# EAGLE design inverter logic (EAGLE 7.6.0)
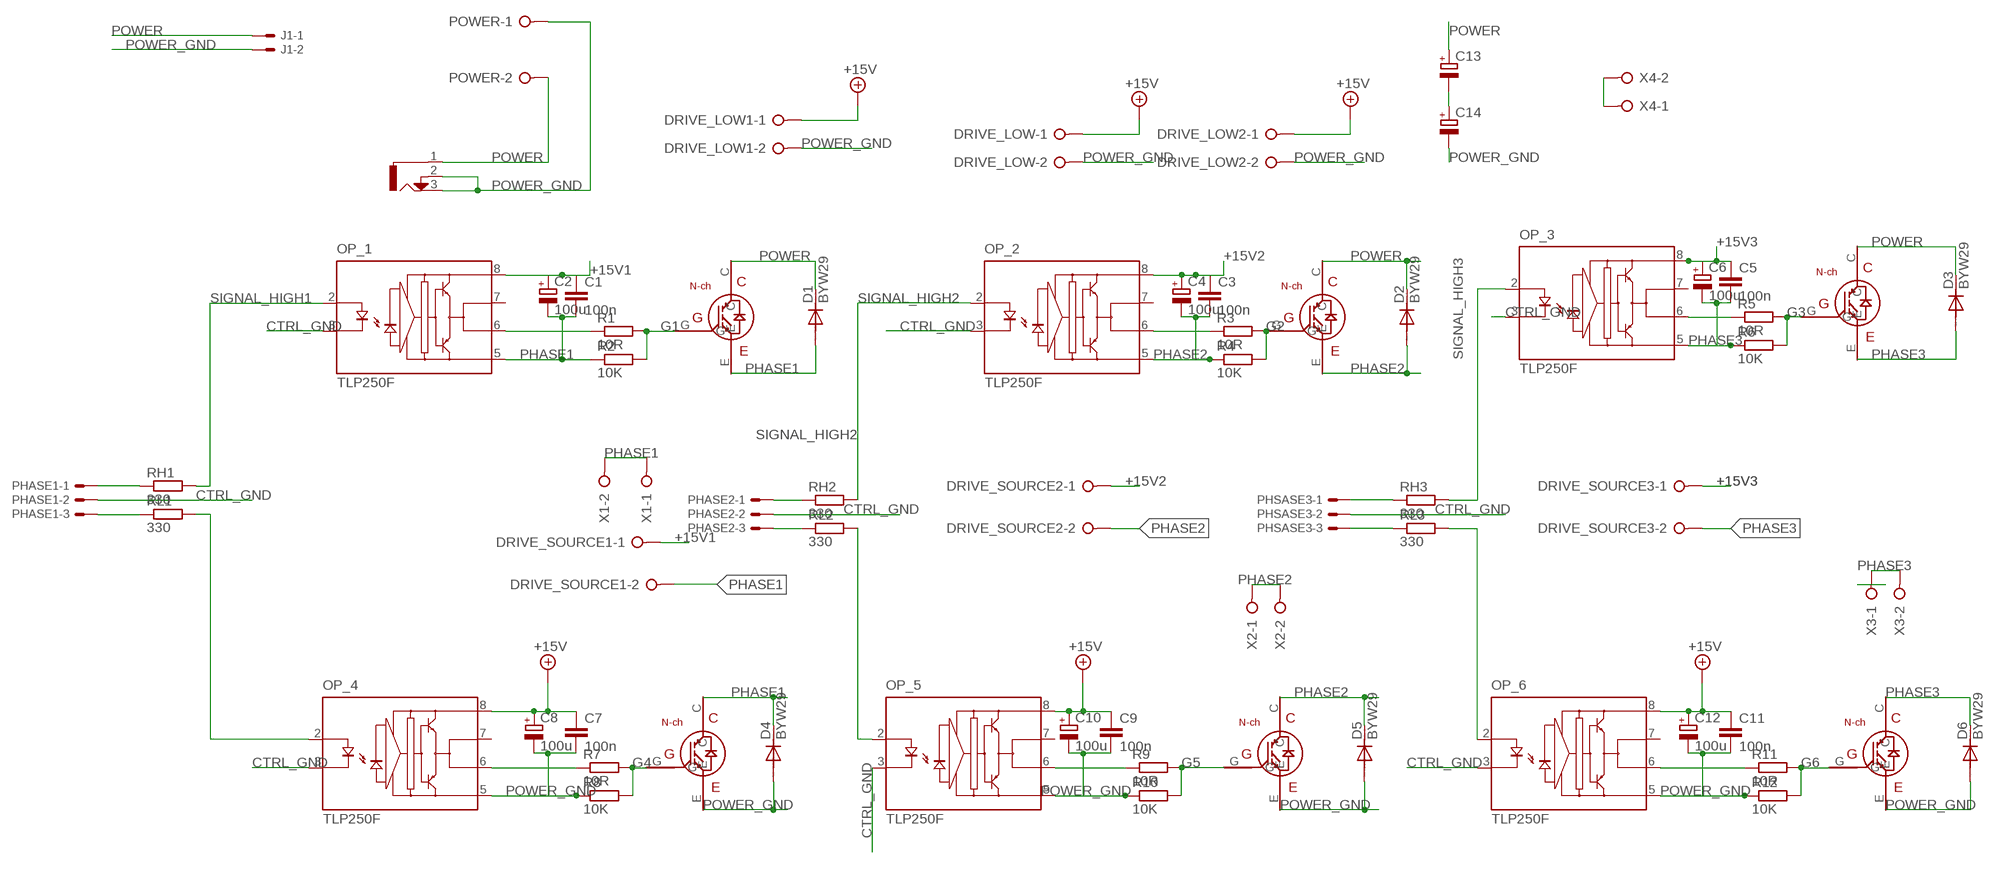
[diagram p0: schematic, sheet 1]

## Parts
C1  100n  C-EU025-025X050  [C025-025X050]
C2  100u  CPOL-EUE2.5-6  [E2,5-6]
C3  100n  C-EU025-025X050  [C025-025X050]
C4  100u  CPOL-EUE2.5-6  [E2,5-6]
C5  100n  C-EU025-025X050  [C025-025X050]
C6  100u  CPOL-EUE2.5-6  [E2,5-6]
C7  100n  C-EU025-025X050  [C025-025X050]
C8  100u  CPOL-EUE2.5-6  [E2,5-6]
C9  100n  C-EU025-025X050  [C025-025X050]
C10  100u  CPOL-EUE2.5-6  [E2,5-6]
C11  100n  C-EU025-025X050  [C025-025X050]
C12  100u  CPOL-EUE2.5-6  [E2,5-6]
C13  CPOL-EUE2.5-6  [E2,5-6]
C14  CPOL-EUE2.5-6  [E2,5-6]
D1  BYW29  [DO220S]
D2  BYW29  [DO220S]
D3  BYW29  [DO220S]
D4  BYW29  [DO220S]
D5  BYW29  [DO220S]
D6  BYW29  [DO220S]
DRIVE_LOW  W237-02P  [W237-132]
DRIVE_LOW1  W237-02P  [W237-132]
DRIVE_LOW2  W237-02P  [W237-132]
DRIVE_SOURCE1  W237-02P  [W237-132]
DRIVE_SOURCE2  W237-02P  [W237-132]
DRIVE_SOURCE3  W237-02P  [W237-132]
J1  22-27-2021-02  [6410-02]
OP_1  TLP250F  [DIL08]
OP_2  TLP250F  [DIL08]
OP_3  TLP250F  [DIL08]
OP_4  TLP250F  [DIL08]
OP_5  TLP250F  [DIL08]
OP_6  TLP250F  [DIL08]
PHASE1  22-27-2031-03  [6410-03]
PHASE2  22-27-2031-03  [6410-03]
PHSASE3  22-27-2031-03  [6410-03]
POWER  W237-02P  [W237-132]
R1  10R  R-EU_0207/10  [0207/10]
R2  10K  R-EU_0207/10  [0207/10]
R3  10R  R-EU_0207/10  [0207/10]
R4  10K  R-EU_0207/10  [0207/10]
R5  10R  R-EU_0207/10  [0207/10]
R6  10K  R-EU_0207/10  [0207/10]
R7  10R  R-EU_0207/10  [0207/10]
R8  10K  R-EU_0207/10  [0207/10]
R9  10R  R-EU_0207/10  [0207/10]
R10  10K  R-EU_0207/10  [0207/10]
R11  10R  R-EU_0207/10  [0207/10]
R12  10K  R-EU_0207/10  [0207/10]
RH1  330  R-EU_0207/10  [0207/10]
RH2  330  R-EU_0207/10  [0207/10]
RH3  330  R-EU_0207/10  [0207/10]
RL1  330  R-EU_0207/10  [0207/10]
RL2  330  R-EU_0207/10  [0207/10]
RL3  330  R-EU_0207/10  [0207/10]
T1  TO-247A  [TO-247]
T2  TO-247A  [TO-247]
T3  TO-247A  [TO-247]
T4  TO-247A  [TO-247]
T5  TO-247A  [TO-247]
T6  TO-247A  [TO-247]
U$1  DC-21MM  [DC-21MM]
X1  W237-02P  [W237-132]
X2  W237-02P  [W237-132]
X3  W237-02P  [W237-132]
X4  W237-02P  [W237-132]

## Nets
+15V: C7.1 C8.+ C9.1 C10.+ C11.1 C12.+ DRIVE_LOW1.1 DRIVE_LOW2.1 DRIVE_LOW.1 OP_4.8(VCC) OP_5.8(VCC) OP_6.8(VCC)
+15V1: C1.1 C2.+ DRIVE_SOURCE1.1 OP_1.8(VCC)
+15V2: C3.1 C4.+ DRIVE_SOURCE2.1 OP_2.8(VCC)
+15V3: C5.1 C6.+ DRIVE_SOURCE3.1 OP_3.8(VCC)
CTRL_GND: OP_1.3(K) OP_2.3(K) OP_3.3(K) OP_4.3(K) OP_5.3(K) OP_6.3(K) PHASE1.2 PHASE2.2 PHSASE3.2
G1: R1.2 R2.2 T1.G
G2: R3.2 R4.2 T2.G
G3: R5.2 R6.2 T3.G
G4: R7.2 R8.2 T4.G
G5: R9.2 R10.2 T5.G
G6: R11.2 R12.2 T6.G
N: C13.- C14.+ X4.1 X4.2
N$1: PHASE1.3 RL1.1
N$2: PHASE2.3 RL2.1
N$3: PHSASE3.3 RL3.1
N$5: PHASE2.1 RH2.1
N$7: PHSASE3.1 RH3.1
N$8: OP_3.6(VO) R5.1
N$9: PHASE1.1 RH1.1
N$13: OP_1.6(VO) R1.1
N$15: OP_2.6(VO) R3.1
N$19: OP_4.6(VO) R7.1
N$21: OP_5.6(VO) R9.1
N$24: OP_6.6(VO) R11.1
PHASE1: C1.2 C2.- D1.A D4.C DRIVE_SOURCE1.2 OP_1.5(GND) R2.1 T1.E T4.C X1.1 X1.2
PHASE2: C3.2 C4.- D2.A D5.C DRIVE_SOURCE2.2 OP_2.5(GND) R4.1 T2.E T5.C X2.1 X2.2
PHASE3: C5.2 C6.- D3.A D6.C DRIVE_SOURCE3.2 OP_3.5(GND) R6.1 T3.E T6.C X3.1 X3.2
POWER: C13.+ D1.C D2.C D3.C J1.1 POWER.2 T1.C T2.C T3.C U$1.1
POWER_GND: C7.2 C8.- C9.2 C10.- C11.2 C12.- C14.- D4.A D5.A D6.A DRIVE_LOW1.2 DRIVE_LOW2.2 DRIVE_LOW.2 J1.2 OP_4.5(GND) OP_5.5(GND) OP_6.5(GND) POWER.1 R8.1 R10.1 R12.1 T4.E T5.E T6.E U$1.2 U$1.3
SIGNAL_HIGH1: OP_1.2(A) RH1.2
SIGNAL_HIGH2: OP_2.2(A) RH2.2
SIGNAL_HIGH3: OP_3.2(A) RH3.2
SIGNAL_LOW1: OP_4.2(A) RL1.2
SIGNAL_LOW2: OP_5.2(A) RL2.2
SIGNAL_LOW3: OP_6.2(A) RL3.2
Unconnected: OP_1.7(VO') OP_2.7(VO') OP_3.7(VO') OP_4.7(VO') OP_5.7(VO') OP_6.7(VO')

## Library data of the parts
C1 C3 C5 C7 C9 C11 = rcl:C-EU: CAPACITOR, European symbol
C2 C4 C6 C8 C10 C12-C14 = rcl:CPOL-EU: POLARIZED CAPACITOR, European symbol
D1-D6 = diode:BYW29: DIODE ultra fast rectifier, 200 V, 8 A
DRIVE_LOW DRIVE_LOW1 DRIVE_LOW2 DRIVE_SOURCE1-DRIVE_SOURCE3 POWER X1-X4 = con-wago-508:W237-02P: WAGO SREW CLAMP; OC_FARNELL: unknown; OC_NEWARK: unknown
J1 = con-molex:22-?-02: CONNECTOR wire to board 2.54 mm (.1 inch) pitch header; OC_FARNELL: unknown; OC_NEWARK: unknown
OP_1-OP_6 = optocoupler-3-jcn:TLP250F: Toshiba Transistor Inverter Inverter For Air Conditionor IGBT Gate Drive Power MOS FET Gate Drive
PHASE1 PHASE2 PHSASE3 = con-molex:22-?-03: CONNECTOR wire to board 2.54 mm (.1 inch) pitch header; OC_FARNELL: unknown; OC_NEWARK: unknown
R1-R12 RH1-RH3 RL1-RL3 = rcl:R-EU_: RESISTOR, European symbol
T1-T6 = to-247_n-channel_igbt:TO-247
U$1 = arduino_Uno_Rev3-02-TH:DC-21MM

## Net classes
0 default: width 1.524 mm, drill 0.254 mm, clearance 0.508 mm

## Board
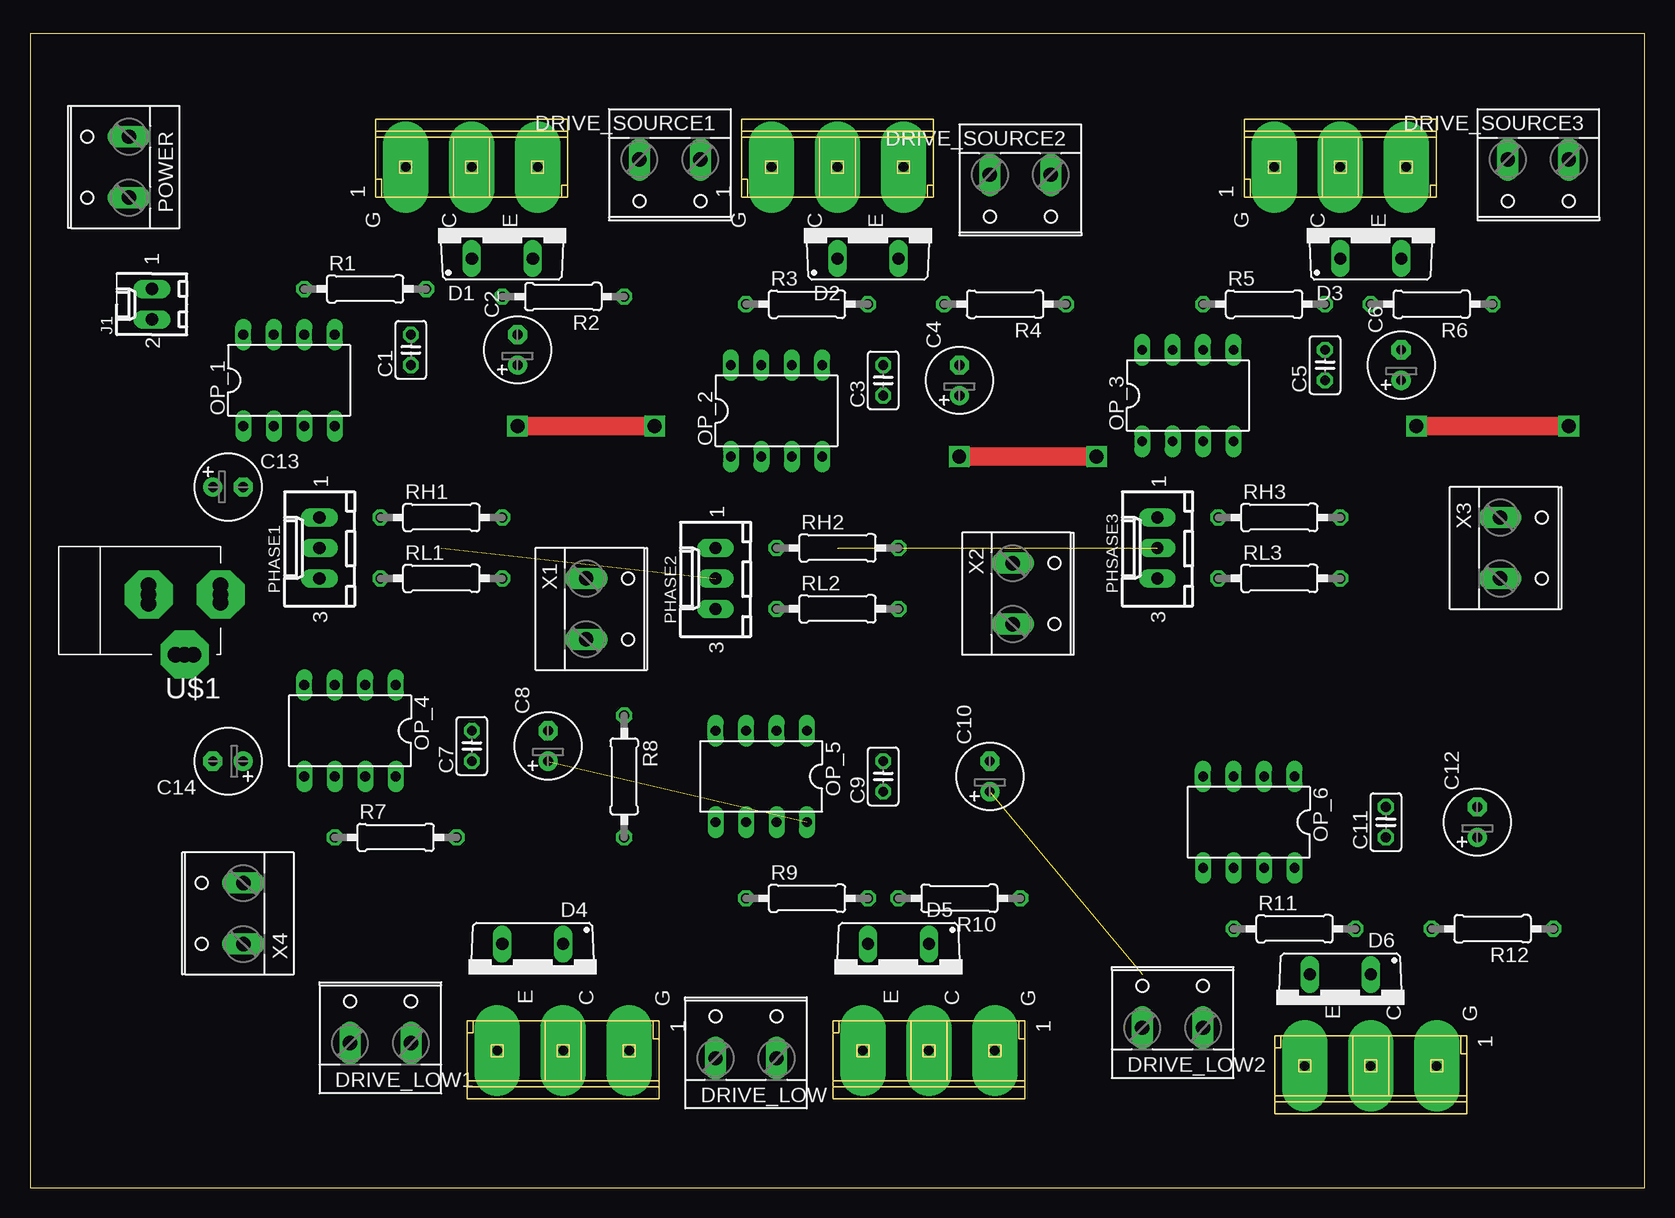
[diagram p1: board, top side]
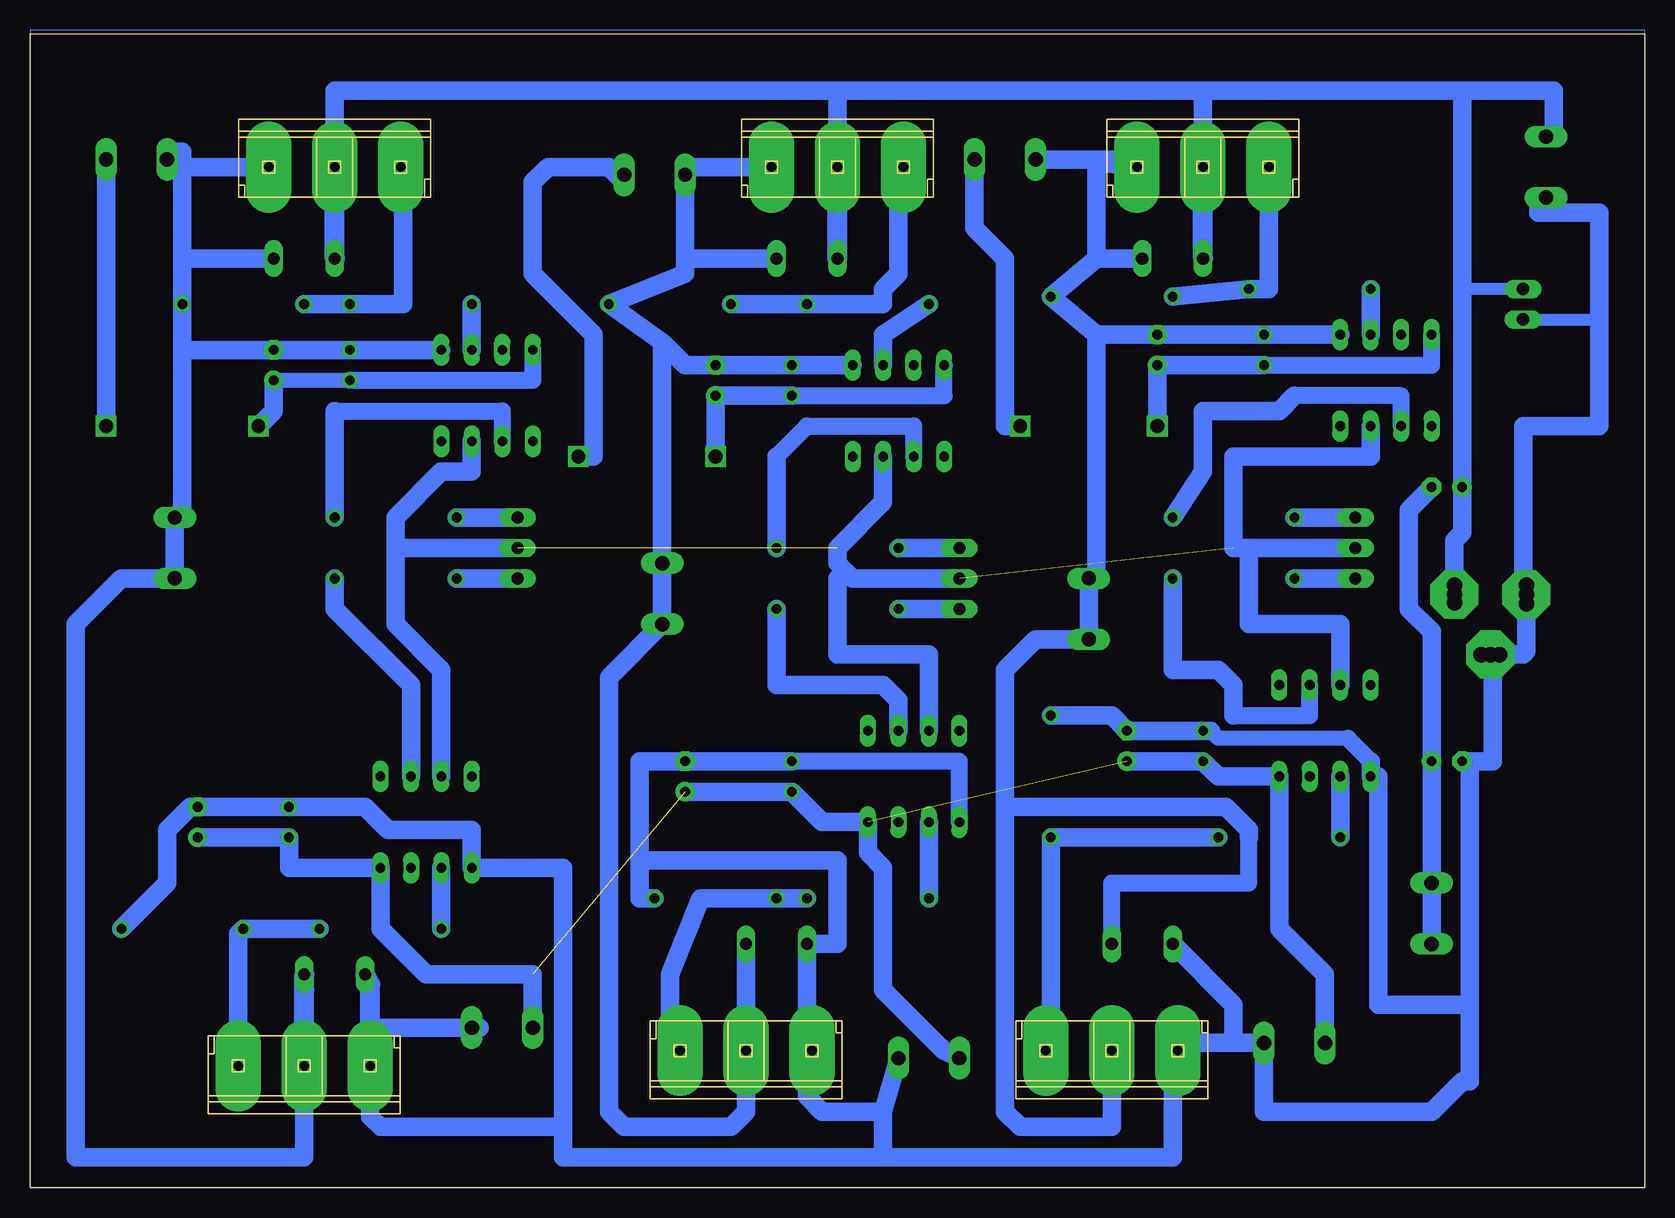
[diagram p2: board, bottom side, seen from below]

Size 134.6 x 96.19 mm. Coordinates in mm from the lower left corner, seen from the top.
Outline: 0,0 134.6,0 134.6,96.19 0,96.19 0,0
Copper layers (1*16): Top 0.035mm / dielectric 1.5mm / Bottom 0.035mm
Design rules "default": minimum track width 10mil, minimum drill 24mil, track to track 8mil, track to pad 8mil, pad to pad 8mil, via to via 8mil, smd to smd 8mil, copper to edge 40mil, drill to drill 8mil, minimum pad ring 10mil, minimum via ring 8mil, stop-mask expansion 4mil, vias tented up to drill 0mil, thermal gap 10mil

### Footprints (pad centres in the part's own frame; a part is rotated, then mirrored left to right if it is on the bottom)
C025-025X050 = drill 0.813 octagon: 1 -1.27,0; 2 1.27,0
E2,5-6 = drill 0.813 pad 1.6: + -1.27,0 | drill 0.813 pad 1.6 octagon: - 1.27,0
DO220S = drill 1.016 long: A 2.54,-2.54; C -2.54,-2.54
W237-132 = drill 1.194 long: 1 -2.54,-0.635; 2 2.54,-0.635
6410-02 = drill 1.016 long: 1 1.27,0; 2 -1.27,0
DIL08 = drill 0.813 long: 1 -3.81,-3.81; 2 -1.27,-3.81; 3 1.27,-3.81; 4 3.81,-3.81; 5 3.81,3.81; 6 1.27,3.81; 7 -1.27,3.81; 8 -3.81,3.81
6410-03 = drill 1.016 long: 1 2.54,0; 2 0,0; 3 -2.54,0
0207/10 = drill 0.813 octagon: 1 -5.08,0; 2 5.08,0
TO-247 = drill 0.8 pad 3.81 long: C 0,0; E 0,-5.5; G 0,5.5
DC-21MM = drill 1.3 pad 4 octagon: 1 -0.076,-3.175; 2 -5.08,-0.178; 3 -0.076,2.819 | drill 1.3: P$1 -0.838,2.819; P$2 -0.762,-3.175; P$3 0.686,2.819; P$4 0.686,-3.175; P$5 -5.08,-0.94; P$6 -5.08,0.584

### Placement (x,y rotation side)
C1  31.75,69.85 90 top
C2  40.64,69.85 90 top
C3  71.12,67.31 90 top
C4  77.47,67.31 90 top
C5  107.95,68.58 90 top
C6  114.3,68.58 90 top
C7  36.83,36.83 90 top
C8  43.18,36.83 90 top
C9  71.12,34.29 90 top
C10  80.01,34.29 90 top
C11  113.03,30.48 90 top
C12  120.65,30.48 90 top
C13  16.51,58.42 0 top
C14  16.51,35.56 180 top
D1  39.37,80.01 0 top
D2  69.85,80.01 0 top
D3  111.76,80.01 0 top
D4  41.91,17.78 180 top
D5  72.39,17.78 180 top
D6  109.22,15.24 180 top
DRIVE_LOW  59.69,11.43 0 top
DRIVE_LOW1  29.21,12.7 0 top
DRIVE_LOW2  95.25,13.97 0 top
DRIVE_SOURCE1  53.34,85.09 180 top
DRIVE_SOURCE2  82.55,83.82 180 top
DRIVE_SOURCE3  125.73,85.09 180 top
J1  10.16,73.66 90 top
OP_1  21.59,67.31 0 top
OP_2  62.23,64.77 0 top
OP_3  96.52,66.04 0 top
OP_4  26.67,38.1 180 top
OP_5  60.96,34.29 180 top
OP_6  101.6,30.48 180 top
PHASE1  24.13,53.34 90 top
PHASE2  57.15,50.8 90 top
PHSASE3  93.98,53.34 90 top
POWER  7.62,85.09 90 top
R1  27.94,74.93 0 top
R2  44.45,74.29 180 top
R3  64.77,73.66 0 top
R4  81.28,73.66 180 top
R5  102.87,73.66 0 top
R6  116.84,73.66 180 top
R7  30.48,29.21 0 top
R8  49.53,34.29 270 top
R9  64.77,24.13 0 top
R10  77.47,24.13 180 top
R11  105.41,21.59 0 top
R12  121.92,21.59 180 top
RH1  34.29,55.88 0 top
RH2  67.31,53.34 0 top
RH3  104.14,55.88 0 top
RL1  34.29,50.8 0 top
RL2  67.31,48.26 0 top
RL3  104.14,50.8 0 top
T1  36.83,85.09 90 top
T2  67.31,85.09 90 top
T3  109.22,85.09 90 top
T4  44.45,11.43 270 top
T5  74.93,11.43 270 top
T6  111.76,10.16 270 top
U$1  12.7,49.53 90 top
X1  46.99,48.26 270 top
X2  82.55,49.53 270 top
X3  123.19,53.34 270 top
X4  17.15,22.86 90 top

### Tracks (layer width: path | path; a pad name or v marks a point on that pad's centre or on a via)
+15V  (2 unrouted)
  Bottom 1.524: C8.+ C7.1 35.56,34.29 OP_4.8 30.48,21.59 26.67,17.78 DRIVE_LOW1.1 | DRIVE_LOW.1 58.42,11.43 63.5,16.51 63.5,26.67 64.77,27.94 OP_5.8 68.58,30.48 C9.1 C10.+ | C12.+ C11.1 113.03,26.67 OP_6.8 105.41,21.59 101.6,17.78 92.71,17.78 DRIVE_LOW2.1 92.71,12.7
+15V1  (via drill 1.14)
  Top 1.524: v40.64,63.5 v52.07,63.5
  Bottom 1.422: C1.1 17.78,68.58 OP_1.8
  Bottom 1.524: C1.1 C2.+ v40.64,63.5 | v52.07,63.5 53.34,63.5 53.34,77.47 55.88,80.01 DRIVE_SOURCE1.1
+15V2  (via drill 1.14)
  Top 1.524: v77.47,60.96 v88.9,60.96
  Bottom 1.422: C3.1 58.42,66.04 OP_2.8
  Bottom 1.524: C3.1 C4.+ v77.47,60.96 | v88.9,60.96 87.63,60.96 87.63,71.12 92.71,76.2 92.71,83.82 91.44,85.09 86.36,85.09 85.41,84.14 | 85.41,84.14 85.09,83.82 | DRIVE_SOURCE2.1 85.41,84.14
+15V3  (via drill 1.14)
  Top 1.524: v115.57,63.5 v128.27,63.5
  Bottom 1.27: C5.1 C6.+
  Bottom 1.422: OP_3.8 92.71,67.31 C5.1
  Bottom 1.524: C6.+ 114.3,64.77 v115.57,63.5 | v128.27,63.5 DRIVE_SOURCE3.1
CTRL_GND  (2 unrouted)
  Bottom 1.524: 66.67,51.44 66.04,50.8 PHASE2.2 | 66.67,51.44 67.31,52.07 67.31,53.34 63.5,57.15 OP_2.3 | OP_5.3 59.69,44.45 67.31,44.45 67.31,50.8 66.67,51.44 | OP_3.3 97.79,59.69 100.33,59.69 104.14,55.88 104.14,53.34 | 104.14,53.34 104.14,46.99 100.33,43.18 OP_6.3 | 22.86,62.23 OP_1.3 22.86,60.96 34.29,60.96 34.29,53.34 33.02,53.34 | PHASE1.2 33.02,53.34 | 33.02,53.34 33.02,46.99 25.4,46.99 OP_4.3 | PHSASE3.2 104.14,53.34
G1
  Bottom 1.524: R2.2 R1.2 31.33,74.93 T1.G
G2
  Bottom 1.524: R4.2 R3.2 63.5,73.66 63.5,74.93 62.23,76.2 62.23,84.67 T2.G
G3
  Bottom 1.524: R6.2 R5.2 103.5,73.66 103.5,84.88 T3.G
G4
  Bottom 1.524: R7.2 R8.2 49.53,11.85 T4.G
G5
  Bottom 1.524: R9.2 R10.2 78.74,24.13 81.28,17.78 81.28,11.43 80.01,10.16 80.01,11.01 T5.G
G6
  Bottom 1.524: R11.2 R12.2 117.26,21.17 T6.G
N
  Bottom 1.524: C13.- 19.69,56.52 19.69,48.26 17.78,46.36 C14.+ X4.2 X4.1
N$1
  Bottom 1.524: PHASE1.3 RL1.1
N$2
  Bottom 1.524: PHASE2.3 RL2.1
N$3
  Bottom 1.524: PHSASE3.3 RL3.1
N$4
  Bottom 0: 1.27,96.52 134.62,96.52 134.62,0 0,0 0,96.52 2.54,96.52
N$5
  Bottom 1.524: PHASE2.1 RH2.1
N$7
  Bottom 1.524: PHSASE3.1 RH3.1
N$8
  Bottom 1.524: R5.1 OP_3.6
N$9
  Bottom 1.524: PHASE1.1 RH1.1
N$13
  Bottom 1.524: OP_1.6 R1.1
N$15
  Bottom 1.524: OP_2.6 63.5,71.12 R3.1
N$19
  Bottom 1.524: OP_4.6 R7.1
N$21
  Bottom 1.524: R9.1 OP_5.6
N$24
  Bottom 1.524: OP_6.6 R11.1
PHASE1
  Bottom 1.422: D4.C 44.45,25.4 33.02,25.4 33.02,29.21
  Bottom 1.524: 45.72,71.12 45.72,50.8 X1.1 X1.2 50.8,45.72 53.34,43.18 53.34,31.75 | 45.72,71.12 C2.- C1.2 OP_1.5 | DRIVE_SOURCE1.2 41.7,85.72 T1.E 45.72,85.51 45.72,77.47 | 53.34,31.75 53.34,6.35 52.07,5.08 44.45,5.08 T4.C | 45.72,77.47 R2.1 45.72,71.12 | 45.72,77.47 D1.A | 53.34,31.75 34.93,31.75 33.02,29.84 33.02,29.21
PHASE2
  Bottom 1.524: OP_2.5 C3.2 C4.- 80.01,68.58 81.92,70.48 | 81.92,70.48 R4.1 80.01,76.2 80.01,77.47 | 80.01,77.47 DRIVE_SOURCE2.2 79.38,85.09 T2.E | 81.92,70.48 X2.1 X2.2 86.36,42.55 86.36,6.35 85.09,5.08 76.2,5.08 74.93,6.35 T5.C D5.C | 80.01,77.47 D2.A
PHASE3
  Bottom 1.524: T3.E 121.92,85.09 | DRIVE_SOURCE3.2 122.55,86.36 121.92,86.36 121.92,85.09 | 121.92,69.85 C6.- C5.2 OP_3.5 | 121.92,69.85 121.92,56.52 X3.1 122.55,51.44 123.19,50.8 | 123.19,50.8 127,50.8 130.81,46.99 130.81,2.54 111.76,2.54 111.76,16.51 | X3.2 123.19,50.8 | 121.92,69.85 R6.1 121.92,77.47 | 121.92,85.09 121.92,77.47 | D3.A 121.92,77.47
  Bottom 1.676: T6.C 111.76,16.51 D6.C
POWER
  Bottom 1.016: J1.1 15.24,74.93
  Bottom 1.524: 15.24,91.44 15.24,74.93 C13.+ 15.24,54.61 15.88,53.98 U$1.1 | 67.31,91.44 109.22,91.44 T3.C | 67.31,91.44 36.83,91.44 | 36.83,91.44 15.24,91.44 | T1.C 36.83,91.44 | T2.C 67.31,91.44 | 15.24,91.44 7.62,91.44 7.62,87.63 POWER.2
  Bottom 1.676: D1.C T1.C | D2.C T2.C | D3.C T3.C
POWER_GND
  Bottom 1.016: J1.2 3.81,72.39
  Bottom 1.27: 36.2,38.1 35.56,37.47 24.77,37.47
  Bottom 1.422: OP_5.5 57.15,35.56 C9.2 | 22.86,35.56 24.77,37.47
  Bottom 1.524: 34.29,12.07 DRIVE_LOW1.2 31.75,6.35 17.78,6.35 15.24,8.89 14.61,8.89 14.61,15.24 | 34.29,12.07 38.31,12.07 T4.E 39.37,11.01 39.37,2.54 63.5,2.54 | R8.1 44.45,39.37 C8.- C7.2 36.2,38.1 | 63.5,6.35 68.58,6.35 69.85,7.62 69.85,11.43 | 69.85,11.43 T5.E | C9.2 C10.- 83.82,35.56 83.82,27.3 | 83.82,27.3 83.82,24.13 R10.1 | DRIVE_LOW.2 63.5,6.35 | 63.5,2.54 90.17,2.54 90.17,5.08 | 14.61,35.56 12.7,35.56 12.7,44.45 | 14.61,35.56 C14.- | 22.86,35.56 OP_4.5 22.23,34.29 22.23,15.24 14.61,15.24 | 12.7,44.45 10.16,44.45 9.88,44.73 U$1.3 10.16,49.45 10.16,63.5 3.81,63.5 3.81,72.39 3.81,81.28 8.89,81.28 8.89,82.55 POWER.1 | 14.61,15.24 14.61,35.56 | D4.A 34.29,15.24 34.29,12.07 | 63.5,2.54 63.5,6.35 | R12.1 123.19,25.4 123.19,29.84 121.28,31.75 C12.- C11.2 106.68,31.75 104.77,29.84 97.79,29.84 OP_6.5 90.17,26.67 90.17,5.08 | 97.16,13.34 DRIVE_LOW2.2 105.62,13.34 T6.E 106.26,5.93 105.41,5.08 90.17,5.08 | 69.85,11.43 D5.A 67.31,20.32 67.31,27.3 83.82,27.3 | 12.7,44.45 U$1.2 13.97,44.45
  Bottom 1.676: T6.E 106.26,16.93 D6.A
SIGNAL_HIGH1
  Bottom 1.422: OP_1.2 20.32,66.04 29.21,66.04
  Bottom 1.524: 29.21,66.04 30.48,64.77 36.83,64.77 36.83,59.69 RH1.2
SIGNAL_HIGH2
  Bottom 1.422: 72.39,60.96 69.85,63.5 60.96,63.5 OP_2.2
  Bottom 1.524: RH2.2 72.39,60.96
SIGNAL_HIGH3
  Bottom 1.422: 109.22,64.77 95.25,64.77 OP_3.2
  Bottom 1.524: RH3.2 109.22,64.77
SIGNAL_LOW1
  Bottom 1.397: 34.29,39.37 27.94,39.37
  Bottom 1.422: 27.94,39.37 OP_4.2
  Bottom 1.524: RL1.2 39.37,43.18 35.56,43.18 34.29,41.91 34.29,39.37
SIGNAL_LOW2
  Bottom 1.524: OP_5.2 62.23,40.64 63.5,41.91 72.39,41.91 RL2.2
SIGNAL_LOW3
  Bottom 1.524: RL3.2 109.22,48.26 102.87,41.91 OP_6.2